# EAGLE design Placa (EAGLE 7.6.0)
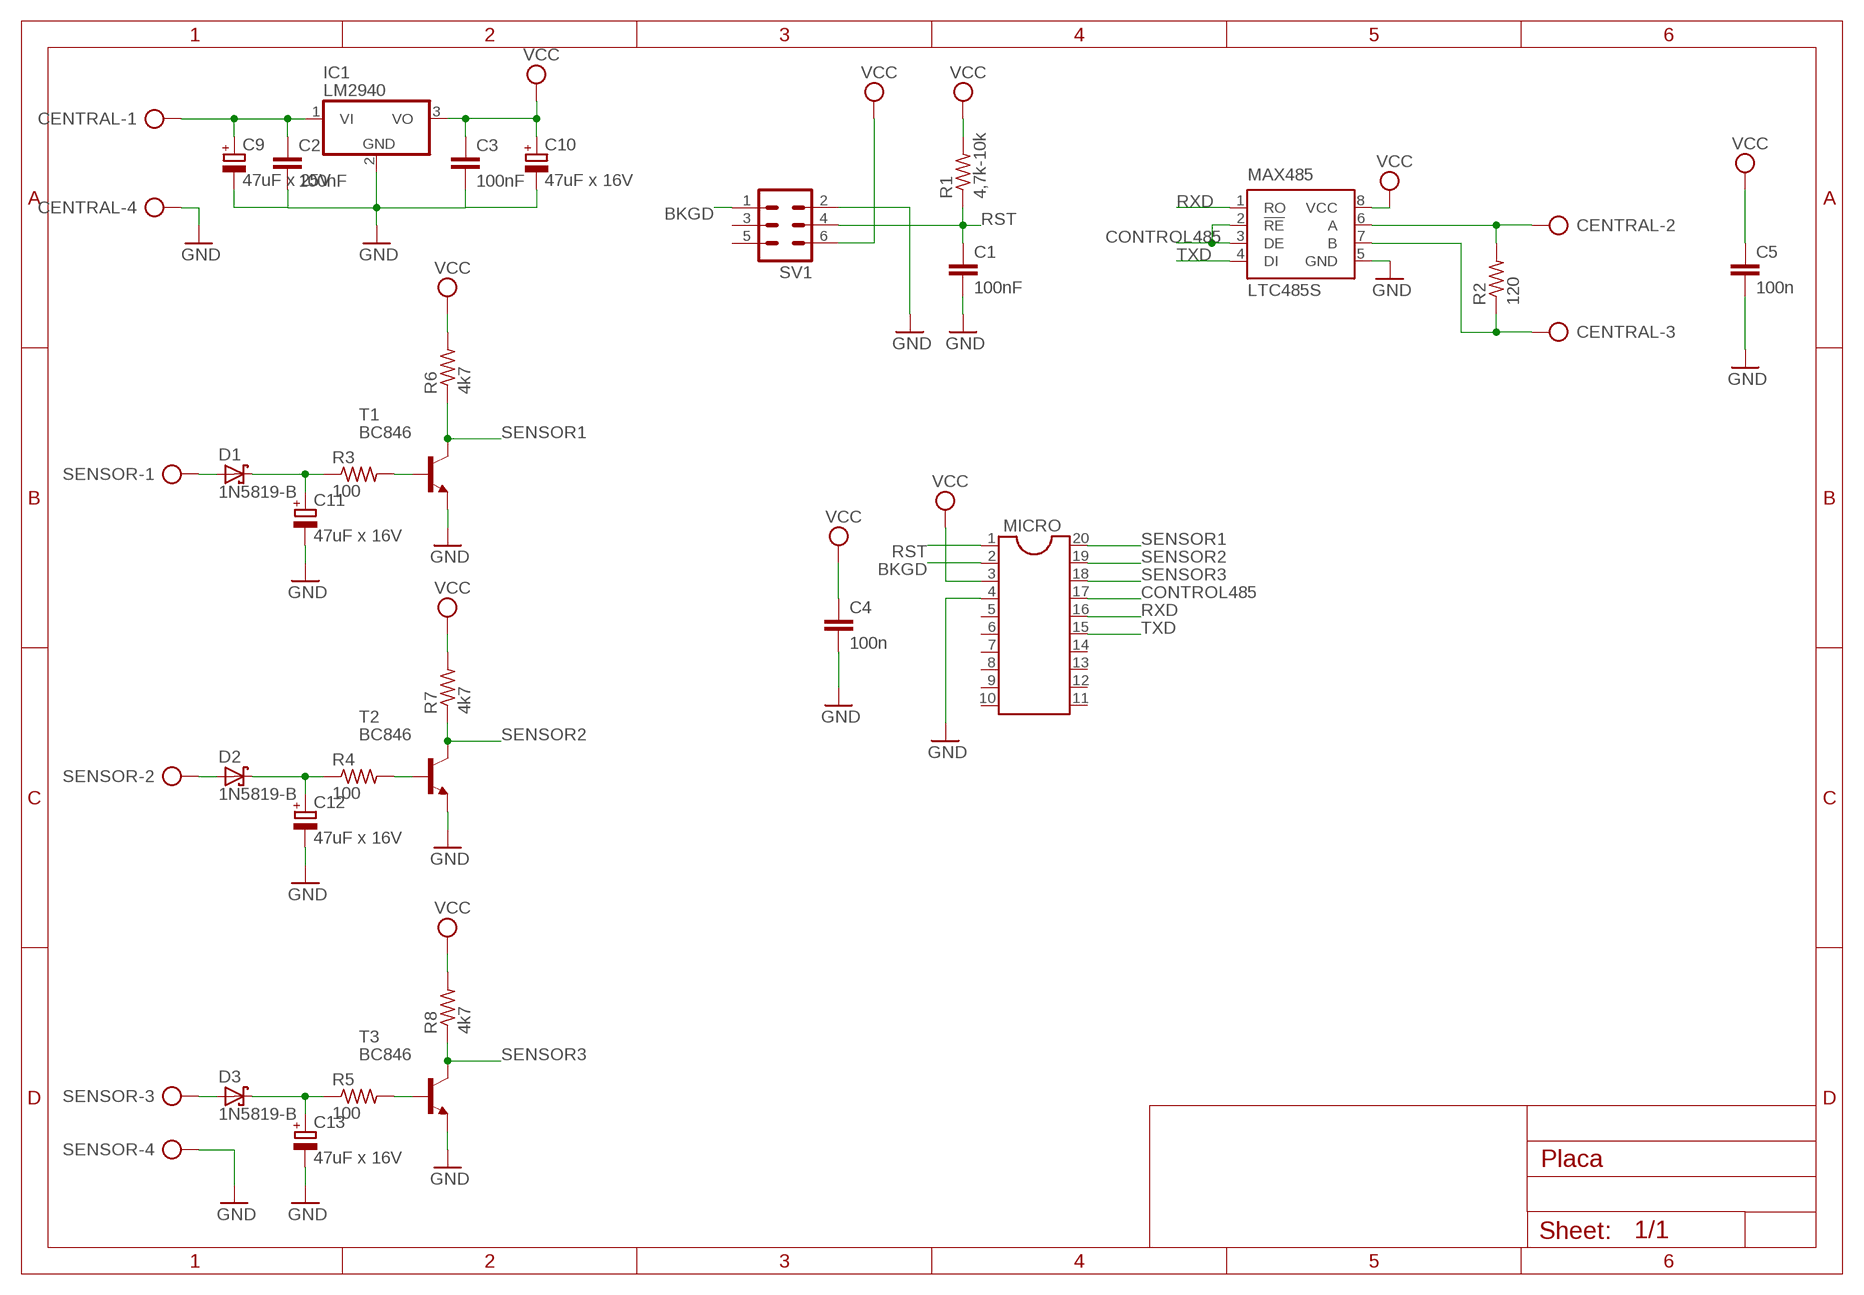
[diagram p0: schematic, sheet 1]

## Parts
C1  100nF  C-EUC0805  [C0805]
C2  100nF  C-EUC0805  [C0805]
C3  100nF  C-EUC0805  [C0805]
C4  100n  C-EUC0805  [C0805]
C5  100n  C-EUC0805  [C0805]
C9  47uF x 25V  CPOL-EUE2,5-6E  [E2,5-6E]
C10  47uF x 16V  CPOL-EUE2,5-6E  [E2,5-6E]
C11  47uF x 16V  CPOL-EUE2,5-6E  [E2,5-6E]
C12  47uF x 16V  CPOL-EUE2,5-6E  [E2,5-6E]
C13  47uF x 16V  CPOL-EUE2,5-6E  [E2,5-6E]
CENTRAL  AK300/4  [AK300/4]
D1  1N5819-B  [DO41-7.6]
D2  1N5819-B  [DO41-7.6]
D3  1N5819-B  [DO41-7.6]
IC1  LM2940  7805TV  [TO220V]
MAX485  LTC485S  [SOIC8]
MICRO  DIL20  [DIL20]
R1  4,7k-10k  R-US_R0805  [R0805]
R2  120  R-US_R0805  [R0805]
R3  100  R-US_R0805  [R0805]
R4  100  R-US_R0805  [R0805]
R5  100  R-US_R0805  [R0805]
R6  4k7  R-US_R0805  [R0805]
R7  4k7  R-US_R0805  [R0805]
R8  4k7  R-US_R0805  [R0805]
SENSOR  AK300/4  [AK300/4]
SV1  MA03-2  [MA03-2]
T1  BC846  [SOT23]
T2  BC846  [SOT23]
T3  BC846  [SOT23]

## Nets
BKGD: MICRO.2 SV1.1
CONTROL485: MAX485.2(!RE) MAX485.3(DE) MICRO.17
GND: C1.2 C2.2 C3.2 C4.2 C5.2 C9.- C10.- C11.- C12.- C13.- CENTRAL.4 IC1.2(GND) MAX485.5(GND) MICRO.4 SENSOR.4 SV1.2 T1.2(E) T2.2(E) T3.2(E)
N$1: C2.1 C9.+ CENTRAL.1 IC1.1(VI)
N$2: CENTRAL.2 MAX485.6(A) R2.2
N$3: CENTRAL.3 MAX485.7(B) R2.1
N$4: D1.A SENSOR.1
N$5: D2.A SENSOR.2
N$6: D3.A SENSOR.3
N$7: C11.+ D1.C R3.1
N$8: C12.+ D2.C R4.1
N$9: C13.+ D3.C R5.1
N$10: R5.2 T3.1(B)
N$12: R4.2 T2.1(B)
N$14: R3.2 T1.1(B)
RST: C1.1 MICRO.1 R1.1 SV1.4
RXD: MAX485.1(RO) MICRO.16
SENSOR1: MICRO.20 R6.1 T1.3(C)
SENSOR2: MICRO.19 R7.1 T2.3(C)
SENSOR3: MICRO.18 R8.1 T3.3(C)
TXD: MAX485.4(DI) MICRO.15
VCC: C3.1 C4.1 C5.1 C10.+ IC1.3(VO) MAX485.8(VCC) MICRO.3 R1.2 R6.2 R7.2 R8.2 SV1.6
Unconnected: MICRO.5 MICRO.6 MICRO.7 MICRO.8 MICRO.9 MICRO.10 MICRO.11 MICRO.12 MICRO.13 MICRO.14 SV1.3 SV1.5

## Library data of the parts
C1-C5 = resistor:C-EU: CAPACITOR, European symbol
C9-C13 = rcl:CPOL-EU: POLARIZED CAPACITOR, European symbol
CENTRAL SENSOR = con-ptr500:AK300/4: CONNECTOR; OC_FARNELL: unknown; OC_NEWARK: unknown
D1-D3 = diode:1N581*: 1.0A SCHOTTKY BARRIER RECTIFIER Source: http://www.diodes.com/datasheets/ds23001.pdf
IC1 = linear:78*: Positive VOLTAGE REGULATOR Source: http://cache.national.com/ds/LM/LM78L05.pdf http://www.fairchildsemi.com/ds/LM/LM7805.pdf
MAX485 = linear-technology:LTC485: Low Power RS485 Interface Transceiver Source: http://www.linear.com/pc/downloadDocument.do?navId=H0,C1,C1007,C1017,P2064,D1718; OC_FARNELL: unknown; OC_NEWARK: unknown
MICRO = ic-package:DIL20: Dual In Line / Socket
R1-R8 = resistor:R-US_: RESISTOR, American symbol
SV1 = con-lstb:MA03-2: PIN HEADER; OC_FARNELL: unknown; OC_NEWARK: unknown
T1-T3 = transistor:BC846: NPN TRANSISTOR

## Board
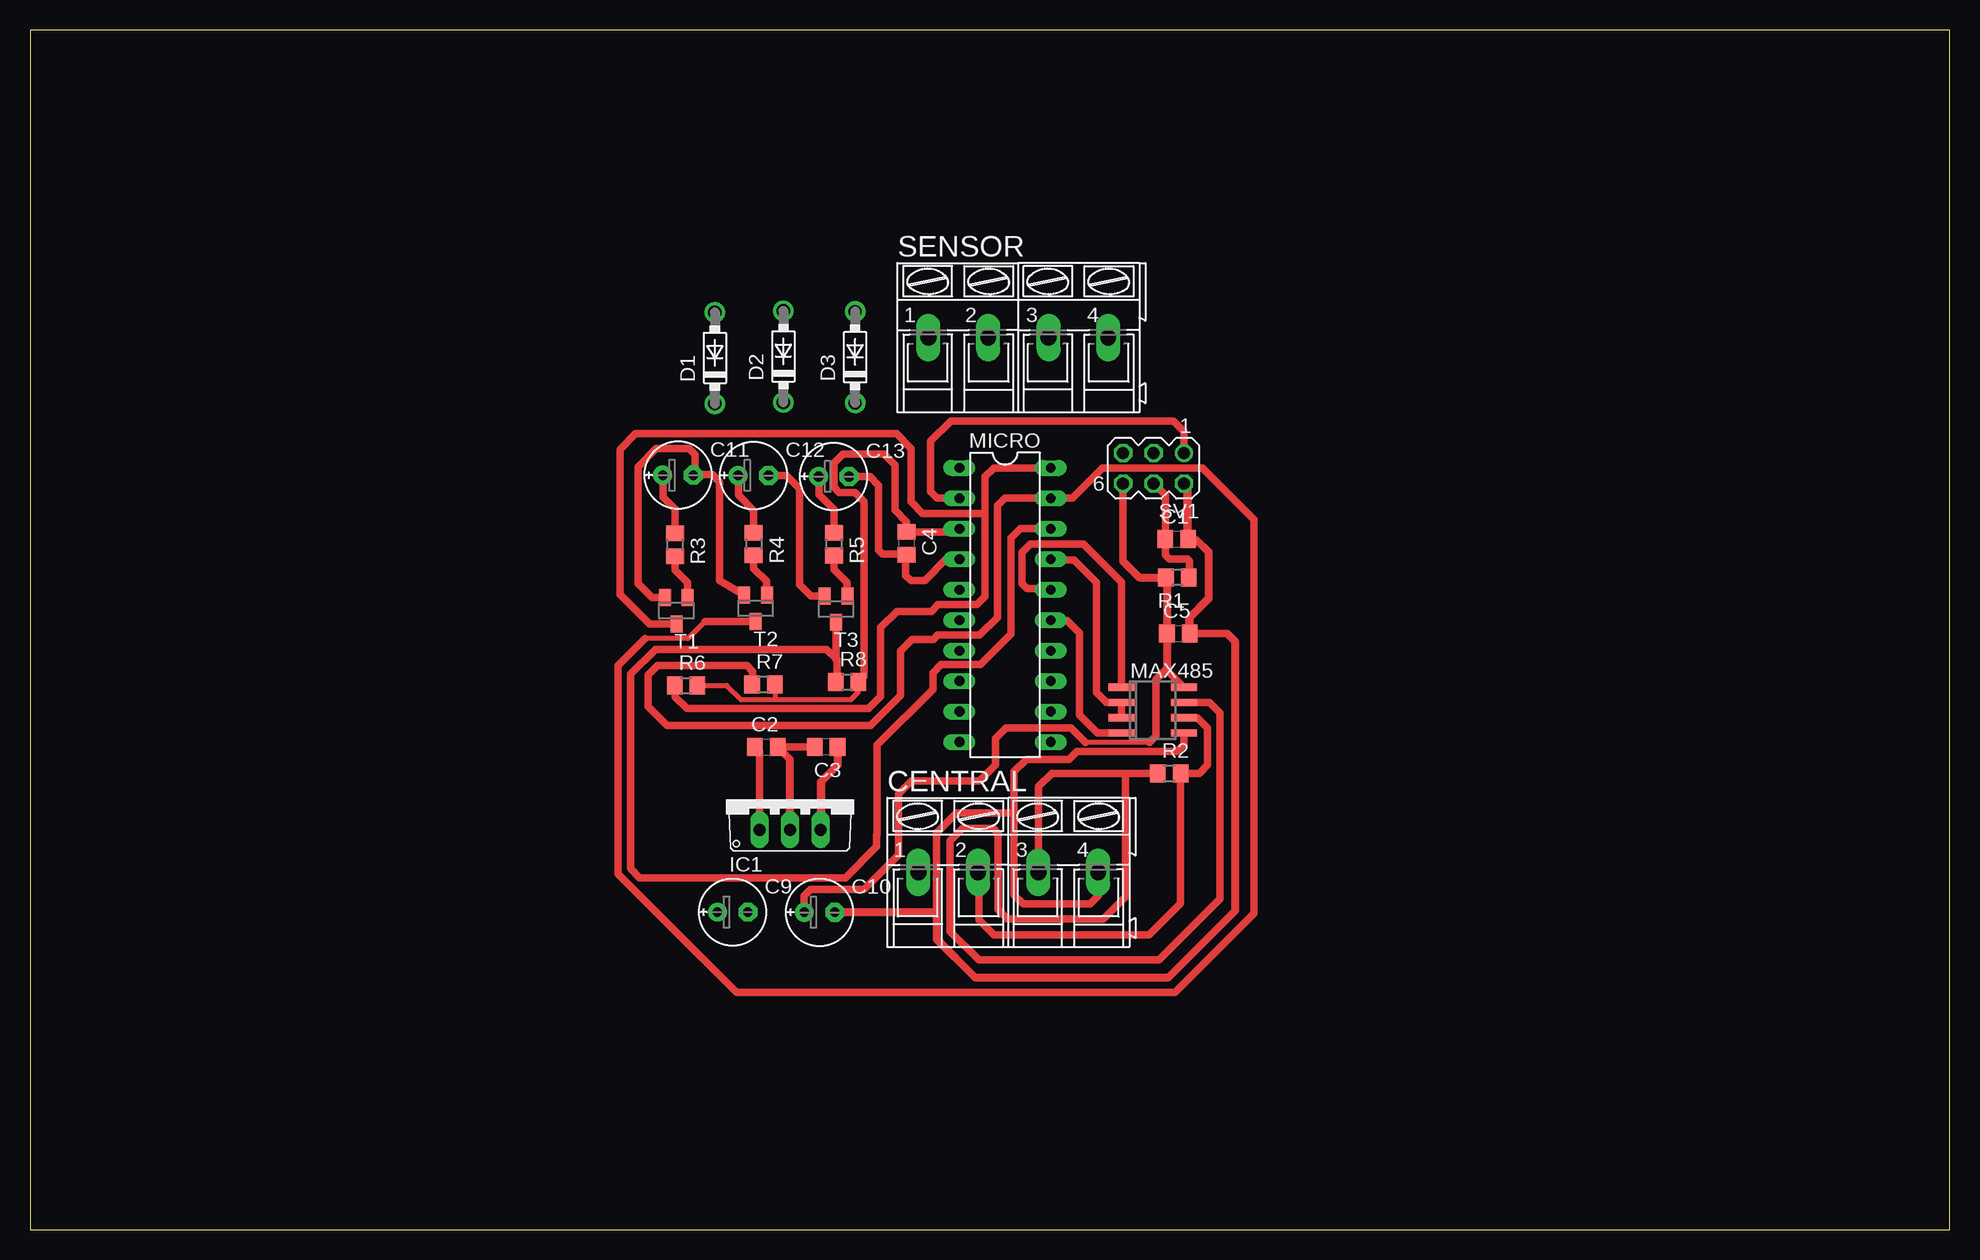
[diagram p1: board, top side]
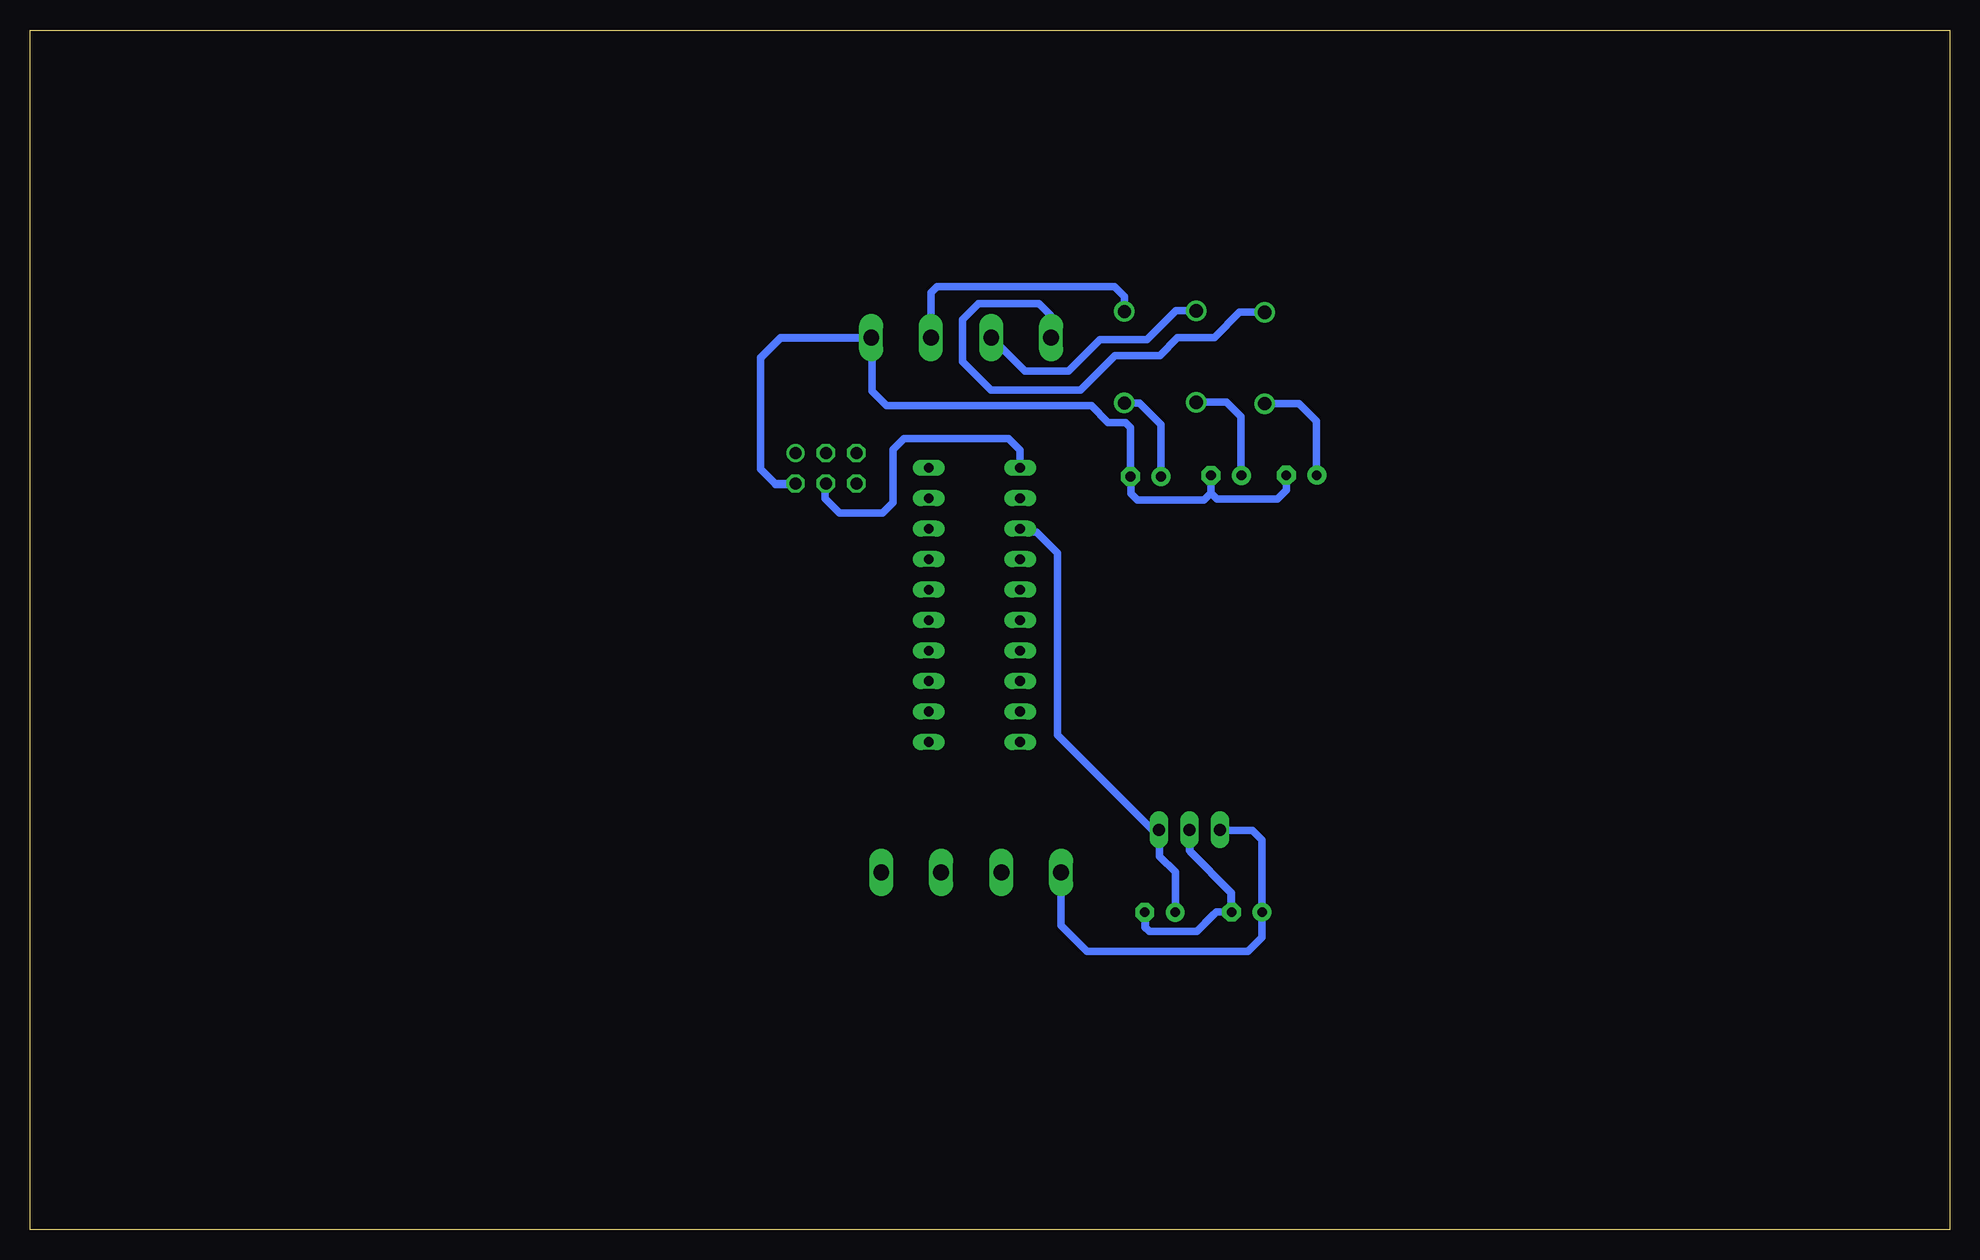
[diagram p2: board, bottom side, seen from below]

Size 160 x 100 mm. Coordinates in mm from the lower left corner, seen from the top.
Outline: 0,0 160,0 160,100 0,100 0,0
Copper layers (1*16): Top 0.035mm / dielectric 1.5mm / Bottom 0.035mm
Design rules "default": minimum track width 10mil, minimum drill 24mil, track to track 8mil, track to pad 8mil, pad to pad 8mil, via to via 8mil, smd to smd 8mil, copper to edge 40mil, drill to drill 8mil, minimum pad ring 10mil, minimum via ring 8mil, stop-mask expansion 4mil, vias tented up to drill 0mil, thermal gap 10mil

### Footprints (pad centres in the part's own frame; a part is rotated, then mirrored left to right if it is on the bottom)
C0805 = smd 1.3 x 1.5: 1 -0.95,0; 2 0.95,0
E2,5-6E = drill 0.813 pad 1.575: + -1.27,0 | drill 0.813 pad 1.575 octagon: - 1.27,0
AK300/4 = drill 1.321 long: 1 -7.493,0; 2 -2.515,0; 3 2.515,0; 4 7.493,0
DO41-7.6 = drill 1.1 pad 1.7: A 3.81,0; C -3.81,0
TO220V = drill 1.016 long: 1 -2.54,-2.54; 2 0,-2.54; 3 2.54,-2.54
SOIC8 = smd 0.6 x 2.2: 1 -1.905,-2.6; 2 -0.635,-2.6; 3 0.635,-2.6; 4 1.905,-2.6; 5 1.905,2.6; 6 0.635,2.6; 7 -0.635,2.6; 8 -1.905,2.6
DIL20 = drill 0.813 long: 1 -11.43,-3.81; 2 -8.89,-3.81; 3 -6.35,-3.81; 4 -3.81,-3.81; 5 -1.27,-3.81; 6 1.27,-3.81; 7 3.81,-3.81; 8 6.35,-3.81; 9 8.89,-3.81; 10 11.43,-3.81; 11 11.43,3.81; 12 8.89,3.81; 13 6.35,3.81; 14 3.81,3.81; 15 1.27,3.81; 16 -1.27,3.81; 17 -3.81,3.81; 18 -6.35,3.81; 19 -8.89,3.81; 20 -11.43,3.81
R0805 = smd 1.3 x 1.5: 1 -0.95,0; 2 0.95,0
MA03-2 = drill 1.016: 1 -2.54,-1.27 | drill 1.016 octagon: 2 -2.54,1.27; 3 0,-1.27; 4 0,1.27; 5 2.54,-1.27; 6 2.54,1.27
SOT23 = smd 1 x 1.4: 1 -0.95,-1.1; 2 0.95,-1.1; 3 0,1.1

### Placement (x,y rotation side)
C1  95.58,57.55 0 top
C2  61.38,40.23 0 top
C3  66.36,40.23 180 top
C4  73.05,57.2 270 top
C5  95.72,49.7 0 top
C9  58.57,26.46 0 top
C10  65.81,26.45 0 top
C11  54.02,62.88 0 top
C12  60.3,62.87 0 top
C13  67,62.77 0 top
CENTRAL  81.55,29.77 0 top
D1  57.09,72.66 90 top
D2  62.8,72.78 90 top
D3  68.78,72.72 90 top
IC1  63.35,35.87 0 top
MAX485  93.58,43.3 270 top
MICRO  81.28,52.07 270 top
R1  95.64,54.35 180 top
R2  94.97,38.04 0 top
R3  53.75,57.08 270 top
R4  60.33,57.15 270 top
R5  67,57.14 270 top
R6  54.69,45.36 0 top
R7  61.13,45.45 0 top
R8  68.1,45.66 0 top
SENSOR  82.39,74.36 0 top
SV1  93.66,63.47 180 top
T1  53.88,51.59 180 top
T2  60.48,51.79 180 top
T3  67.17,51.72 180 top

### Tracks (layer width: path | path; a pad name or v marks a point on that pad's centre or on a via)
BKGD
  Top 0.61: MICRO.2 75.61,60.96 75.06,61.51 75.06,65.72 76.75,67.41 95.3,67.41 96.19,66.52 96.19,64.75 SV1.1
CONTROL485
  Top 0.61: MAX485.3 MAX485.2 89.72,43.94 88.89,44.76 88.89,53.95 87.03,55.81 85.16,55.81 MICRO.17
GND  (via drill 0.6)
  Top 0.61: MAX485.5 96.19,40.44 95.59,39.85 87.27,39.85 86.61,39.19 83.05,39.19 82.03,38.17 82.03,34.83 | 82.03,34.83 82.03,27.91 82.81,27.14 88.34,27.14 89.05,27.86 89.05,29.76 CENTRAL.4 | 75.58,26.23 75.58,24.2 78.75,21.02 94.9,21.02 100.47,26.59 100.47,48.99 99.77,49.7 C5.2 96.67,51.02 98.27,52.62 98.27,56.47 97.25,57.49 96.59,57.49 C1.2 96.53,61.87 SV1.2 | 75.58,26.23 75.58,33.06 77.25,34.73 81.93,34.73 82.03,34.83 | C13.- 70,62.77 70.74,62.04 70.74,56.63 71.06,56.31 72.99,56.31 C4.2 73,56.2 73,54.54 73.42,54.12 74.61,54.12 76.37,55.88 MICRO.4 | C10.- 75.36,26.45 75.58,26.23 | IC1.2 63.35,39.2 C2.2 62.43,40.23 | C3.2 62.43,40.23 | T1.2 51.84,52.69 50.67,53.86 50.67,63.56 52.19,65.08 54.94,65.08 55.42,64.59 55.42,63.02 C11.- 55.33,62.92 56.89,62.92 57.49,62.32 57.49,54.1 T2.2 | T3.2 65.09,52.82 64.13,53.78 64.13,61.78 63.07,62.84 61.59,62.84 C12.- | 62.43,40.23 62.4,40.2 62.4,40.16 63.31,39.24 63.31,33.42 v63.35,33.38 | v67.12,26.47 75.56,26.47 75.56,24.25 78.82,21 94.86,21 100.42,26.55 100.42,48.9 100.45,48.92 100.45,49.05 99.81,49.69 96.63,49.69 96.6,49.66 96.6,50.98 98.25,52.63 98.25,56.46 97.22,57.48 96.78,57.48 96.45,57.8 96.45,61.98 v96.25,62.19
  Bottom 0.61: C11.- 55.28,61.66 56.03,60.91 61.05,60.91 61.55,61.4 61.55,62.84 C12.- 61.57,61.4 62.16,60.81 67.67,60.81 68.23,61.37 68.23,62.74 C13.- 68.28,62.78 68.28,66.86 68.69,67.28 70.14,67.28 71.54,68.69 88.59,68.69 89.81,69.91 89.81,74.33 89.83,74.31 97.45,74.31 99.1,72.66 | SENSOR.4 97.44,74.36 99.1,72.69 99.1,72.66 | 99.1,63.4 99.1,63.38 97.83,62.12 96.28,62.12 SV1.2 | IC1.2 63.31,33.28 63.31,31.55 59.84,28.07 C9.- 61.1,26.46 62.72,24.84 66.7,24.84 67.05,25.2 67.05,26.42 C10.- | v63.35,33.38 63.35,31.59 63.28,31.53 63.28,31.48 59.88,28.07 59.88,26.51 59.91,26.48 61.1,26.48 61.38,26.21 62.75,24.85 66.7,24.85 67.04,25.19 67.04,26.39 v67.12,26.47 | v96.25,62.19 97.78,62.19 97.86,62.1 97.86,62.16 99.1,63.4 | 99.1,63.4 99.1,72.66
N$1
  Top 0.61: IC1.1 60.81,39.84 C2.1
  Bottom 0.61: IC1.1 60.77,33.28 58.09,33.28 57.3,32.48 C9.+ 57.31,26.45 57.31,24.35 58.46,23.2 71.92,23.2 74.05,25.34 CENTRAL.1
N$2
  Top 0.61: MAX485.6 96.22,42.63 97.33,42.63 98.16,41.8 98.16,38.71 97.49,38.04 R2.2 95.92,27.2 93.26,24.55 80.36,24.55 79.08,25.82 79.08,29.71 CENTRAL.2
N$3
  Top 0.61: R2.1 91.46,38.04 | 91.46,38.04 85.18,38.04 84.06,36.92 CENTRAL.3 | MAX485.7 98.33,43.94 99.2,43.06 99.2,27.55 94.12,22.46 79.09,22.46 76.7,24.86 76.7,32.38 77.74,33.42 80.31,33.42 80.7,33.03 80.7,26.68 81.48,25.91 89.48,25.91 91.32,27.74 91.32,37.9 91.46,38.04
N$4
  Bottom 0.61: D1.A 59.19,76.47 61.29,74.36 64.33,74.36 65.82,72.88 69.55,72.88 72.42,70 79.91,70 82.28,72.37 82.28,75.84 80.94,77.19 75.89,77.19 74.92,76.22 74.92,74.38 SENSOR.1
N$5
  Bottom 0.61: D2.A 64.48,76.58 66.88,74.19 70.81,74.19 73.44,71.56 77.08,71.56 SENSOR.2
N$6
  Bottom 0.61: D3.A 68.78,77.78 69.59,78.59 84.4,78.59 84.91,78.08 SENSOR.3
N$7
  Top 0.61: R3.1 53.75,60.08 52.77,61.05 52.77,62.85 C11.+
  Bottom 0.61: D1.C 54.22,68.84 52.77,67.4 52.77,62.91 C11.+
N$8
  Top 0.61: R4.1 60.33,59.95 59.05,61.23 59.05,62.84 C12.+
  Bottom 0.61: D2.C 60.28,68.97 59.08,67.76 59.08,62.91 C12.+
N$9
  Top 0.61: R5.1 67,60.02 65.75,61.27 65.75,62.74 C13.+
  Bottom 0.61: D3.C 67.54,68.91 65.73,67.09 C13.+
N$10
  Top 0.61: R5.2 67,55.04 68.12,53.92 T3.1
N$12
  Top 0.61: R4.2 60.33,55.12 61.38,54.06 61.38,52.94 T2.1
N$14
  Top 0.61: R3.2 53.75,54.99 54.82,53.92 T1.1
RST
  Top 0.61: SV1.4 94.62,61.23 C1.1 94.62,56.23 94.96,55.89 96.47,55.89 96.63,55.73 96.63,54.4 R1.1
  Bottom 0.61: MICRO.1 77.47,64.98 78.44,65.95 87.16,65.95 88.08,65.04 88.08,60.59 88.95,59.71 92.52,59.71 93.75,60.95 93.75,62.1 SV1.4
RXD
  Top 0.61: MAX485.1 90.98,53.99 87.81,57.16 83.38,57.16 82.67,56.45 82.67,53.87 83.11,53.42 85,53.42 MICRO.16
SENSOR1
  Top 0.61: MICRO.20 80.36,63.5 79.62,62.76 79.62,59.69 | 79.62,59.69 79.62,52.76 78.94,52.09 75.69,52.09 75.14,51.53 72.27,51.53 70.9,50.17 70.9,44.45 69.88,43.43 54.75,43.43 53.77,44.41 53.77,45.33 R6.1 | T1.3 51.63,50.49 49.17,52.95 49.17,65.03 50.49,66.36 72.21,66.36 73.44,65.12 73.44,60.67 74.41,59.7 79.6,59.7 79.62,59.69
SENSOR2
  Top 0.406: 56.27,50.69 54.84,49.26 51.27,49.26
  Top 0.61: R7.1 60.24,45.51 60.24,46.54 59.75,47.03 52.31,47.03 51.52,46.23 51.52,43.62 53.11,42.02 70.06,42.02 72.56,44.52 72.56,48.25 73.51,49.2 75.31,49.2 75.64,49.55 79.16,49.55 80.64,51.02 80.64,60.34 81.25,60.96 MICRO.19 85.11,60.98 86.9,60.98 89.42,63.49 97.73,63.49 102.02,59.2 102.02,26.38 95.42,19.78 58.91,19.78 49.03,29.66 49.03,47.02 51.27,49.26 | T2.3 56.27,50.69
SENSOR3
  Top 0.61: MICRO.18 82.57,58.42 81.78,57.63 81.78,49.63 79.24,47.09 75.94,47.09 75.26,46.41 75.26,45.03 70.61,40.38 70.61,32.94 70.58,32.91 70.58,31.94 67.97,29.32 50.83,29.32 50.06,30.09 50.06,46.3 52.13,48.37 66.39,48.37 67.25,47.52 67.25,47.46 | 67.25,47.46 67.25,45.76 R8.1 | T3.3 67.17,47.53 67.25,47.46
TXD
  Top 0.61: MAX485.4 89,41.4 87.5,42.9 87.5,49.71 86.44,50.77 85.12,50.77 MICRO.15
VCC  (via drill 0.6)
  Top 0.406: 93.31,40.61 87.99,40.61 | R6.2 58.08,45.36 59.27,44.17 62.04,44.17 | 62.04,44.17 68.42,44.17 69.06,44.8 69.06,45.65 R8.2 | R7.2 62.09,44.22 62.04,44.17
  Top 0.61: MAX485.8 94.77,46.62 C5.1 94.77,54.27 R1.2 92.44,54.35 91.11,55.69 | 91.11,55.69 91.11,62.19 SV1.6 | MICRO.3 77.2,58.16 C4.1 73.05,59 72.08,59.96 72.08,63.74 71.17,64.66 67.77,64.66 67,63.9 67,61.88 67.44,61.45 68.75,61.45 69.51,60.69 69.51,46.12 R8.2 | IC1.3 65.89,37.3 67.34,38.74 67.34,40.2 C3.1 67.31,38.84 67.37,38.78 65.96,37.37 65.96,33.45 v65.89,33.38 | 91.11,55.69 91.14,55.69 92.52,54.31 94.53,54.31 94.6,54.24 94.6,53.81 94.81,53.6 94.81,46.69 94.78,46.66 94.64,46.66 93.86,45.88 93.86,41.16 93.31,40.61 | 87.99,40.61 86.78,41.81 81.37,41.81 80.48,40.93 80.48,38.73 79.14,37.39 73.47,37.39 72.38,36.3 72.38,31.21 69.5,28.34 65.07,28.34 64.54,27.82 C10.+
  Bottom 0.61: C10.+ 64.54,29.82 65.85,31.12 65.85,33.28 IC1.3 | v65.89,33.38 66.52,33.38 74.36,41.23 74.36,56.4 76.12,58.16 77.2,58.16 MICRO.3